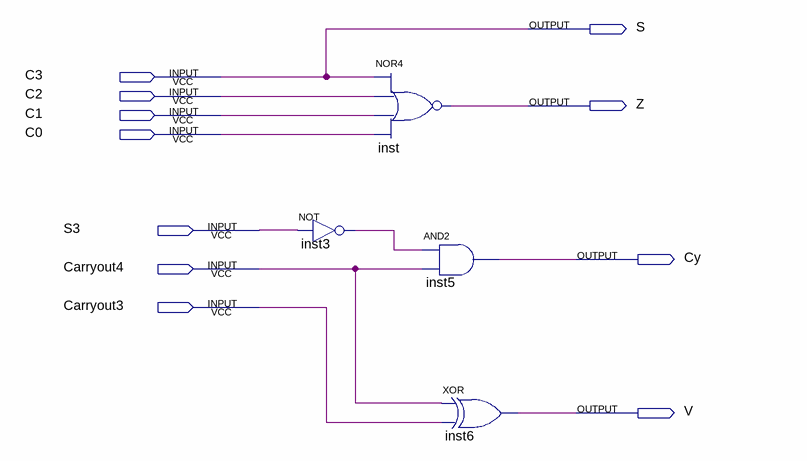
[diagram p0: schematic sheet]
// Quartus schematic state4bits.bdf as structural Verilog: 4 symbols, 11 pins
module state4bits (
  input  C3,
  input  C2,
  input  C1,
  input  C0,
  input  S3,
  input  Carryout4,
  input  Carryout3,
  output S,
  output Z,
  output Cy,
  output V
);

  wire inst3_out;

  not inst3 (inst3_out, S3);
  nor inst (Z, C3, C2, C1, C0);
  and inst5 (Cy, inst3_out, Carryout4);
  xor inst6 (V, Carryout4, Carryout3);

  assign S = C3;
endmodule
